# Altium schematic sheet POLLLUTAG_1.SchDoc
size 420 x 297 mm; Scale: {Масш.}; Title1str: {Наименование}; PageSetup: Record=PageOptions|CenterHorizontal=False|CenterVertical=False|PrintScale=0.67|XCorrection=0.00|YCorrection=0.00|PrintKind=1|BorderSize=5000000|LeftOffset=0|BottomOffset=0|Orientation=2|PaperLength=2970|PaperWidth=2100|Scale=100|PaperSource=7|PrintQuality=600|MediaType=1|DitherType=10|PaperKind=A4|PrintScaleMode=1; Title2str: {Наименование}; Mass: {Масса}; Letter1Column: {}; Letter2Column: {}; Letter3Column: {}; DocumentType: Панель индикации; DocumentType1str: {Документ}; DocumentType2str: {Документ}
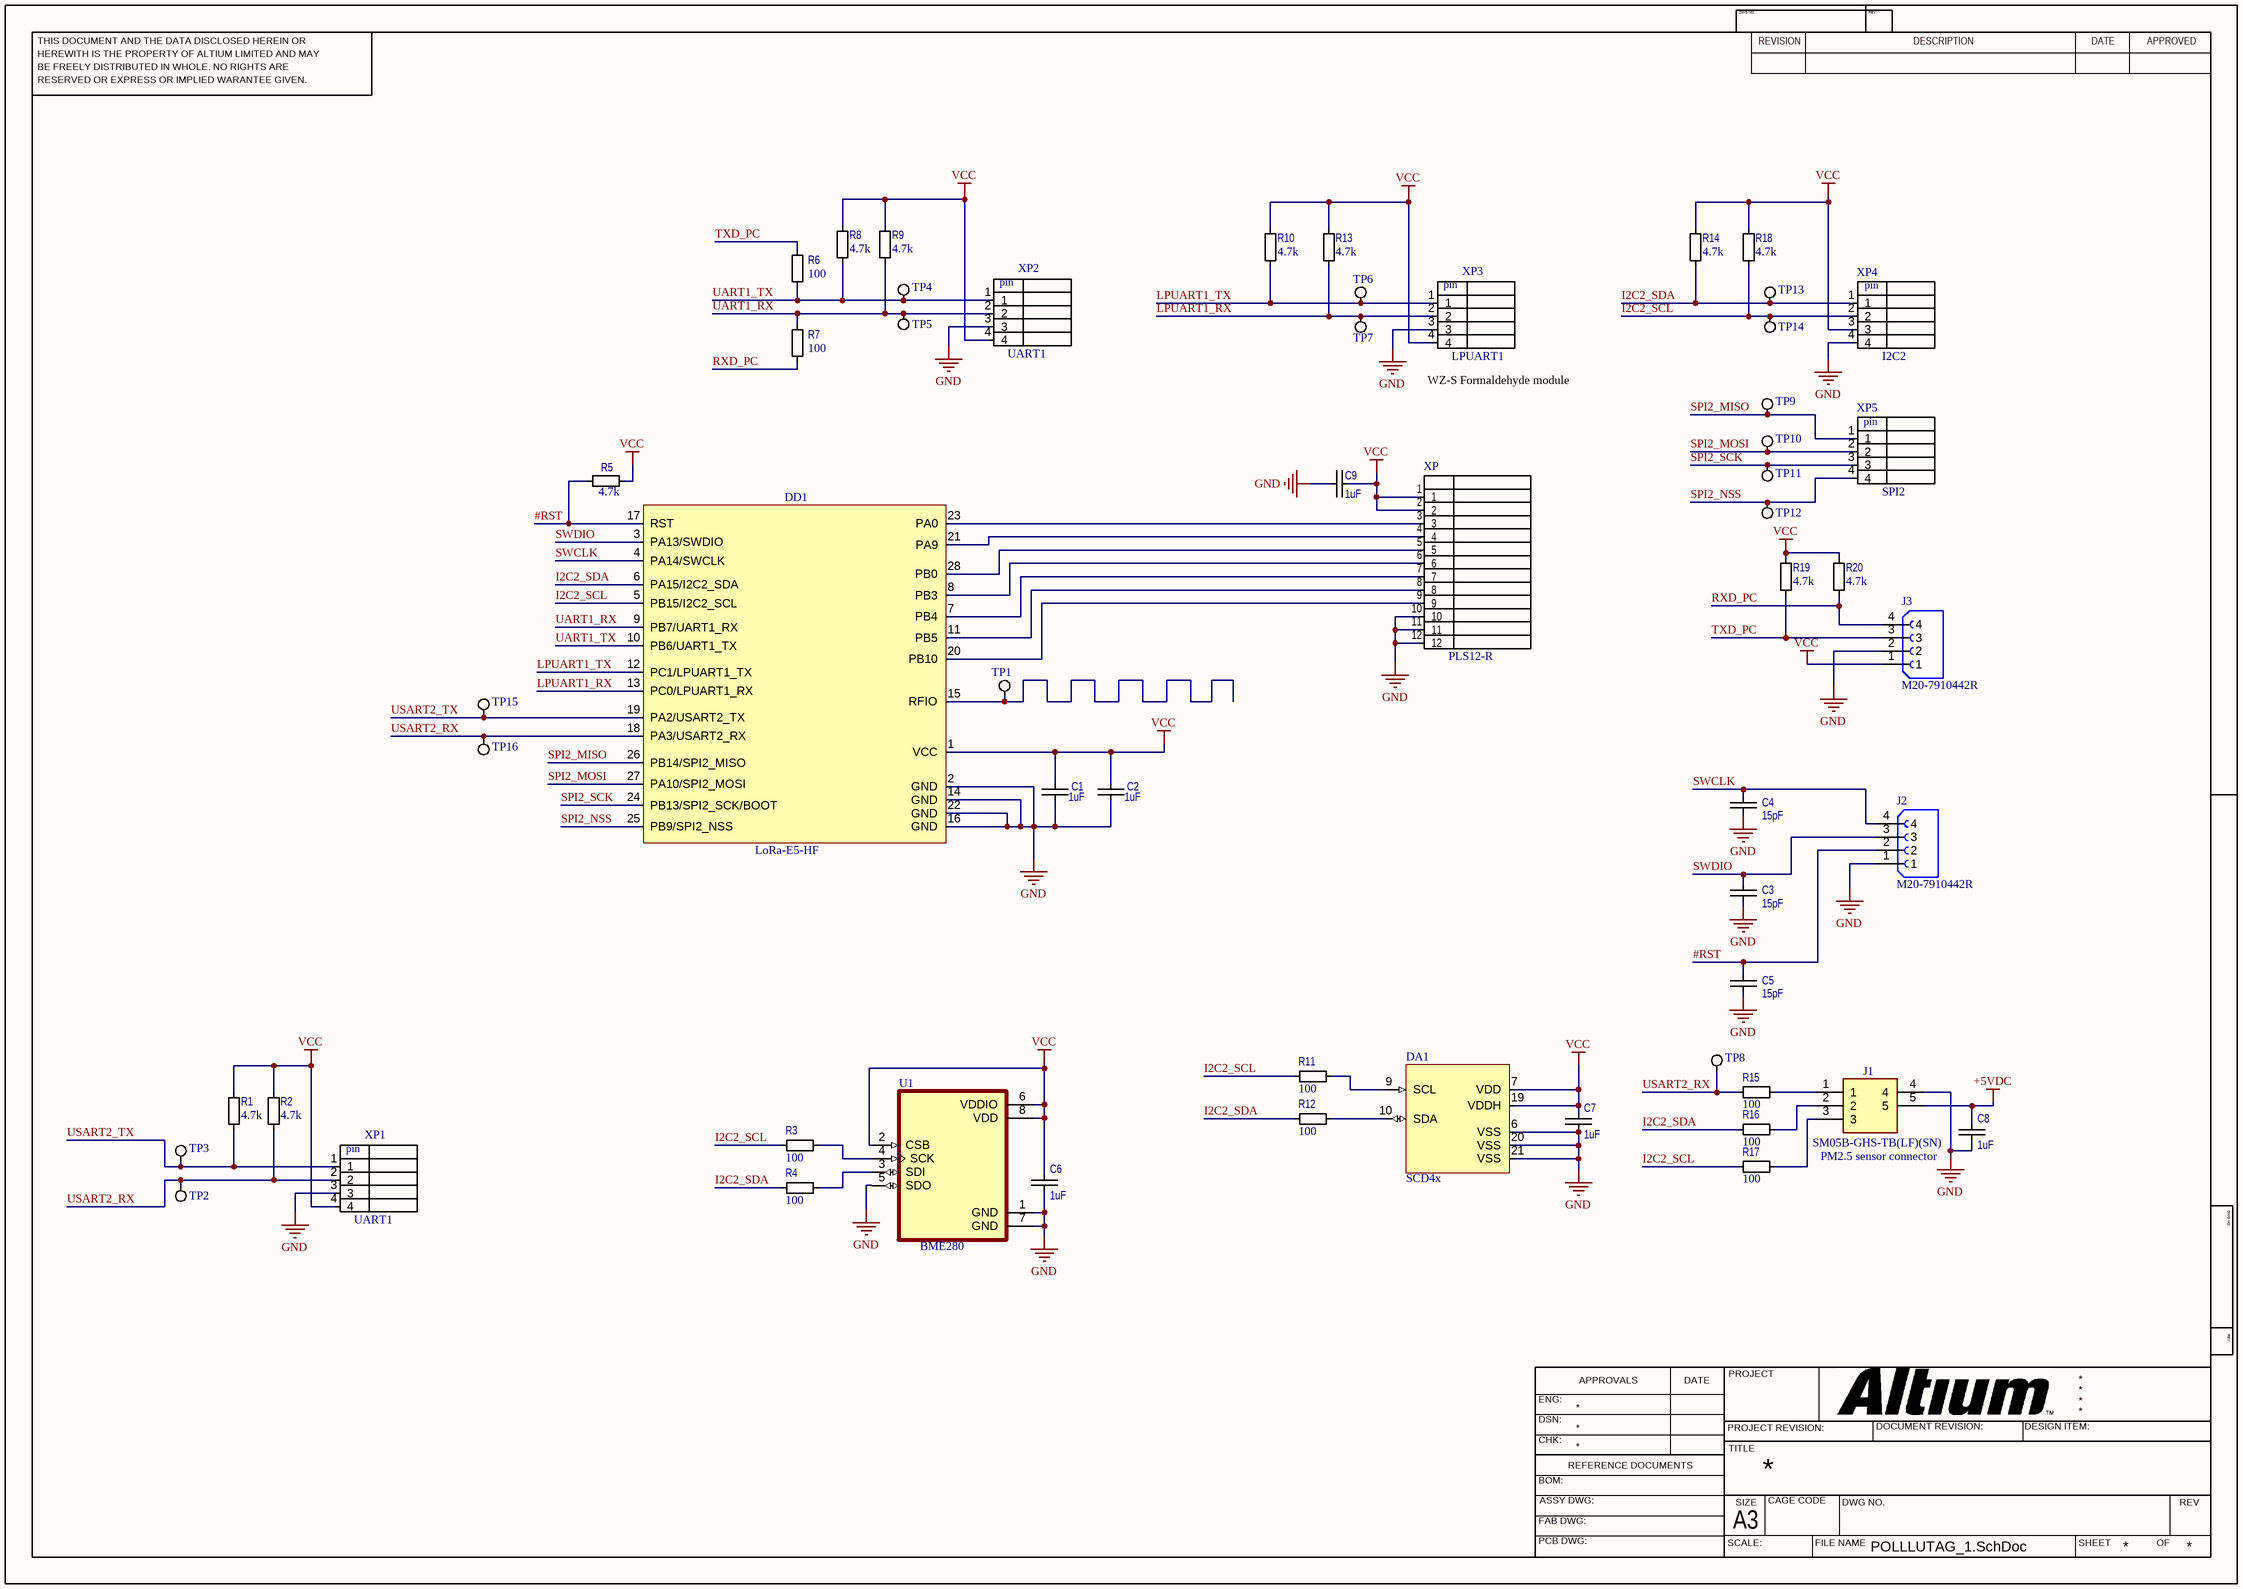
[diagram p0: POLLLUTAG_1.SchDoc]

## Parts
C1  1uF  [CAP_0603]
C2  1uF  [CAP_0603]
C3  15pF  [CAP_0603]
C4  15pF  [CAP_0603]
C5  15pF  [CAP_0603]
C6  1uF  [CAP_0603]
C7  1uF  [CAP_0603]
C8  1uF  [CAP_0603]
C9  1uF  [CAP_0603]
DA1  SCD4x  [SCD4x]
DD1  LoRa-E5-HF  [LCC28_1.25_7x7]
J1  SM05B-GHS-TB(LF)(SN)  [SM05B-GHS-TB]
J2  M20-7910442R  [M20-7910442R]
J3  M20-7910442R  [M20-7910442R]
R1  4.7k  [RES_0402]
R2  4.7k  [RES_0402]
R3  100  [RES_0402]
R4  100  [RES_0402]
R5  4.7k  [RES_0402]
R6  100  [RES_0402]
R7  100  [RES_0402]
R8  4.7k  [RES_0402]
R9  4.7k  [RES_0402]
R10  4.7k  [RES_0402]
R11  100  [RES_0402]
R12  100  [RES_0402]
R13  4.7k  [RES_0402]
R14  4.7k  [RES_0402]
R15  100  [RES_0402]
R16  100  [RES_0402]
R17  100  [RES_0402]
R18  4.7k  [RES_0402]
R19  4.7k  [RES_0402]
R20  4.7k  [RES_0402]
TP1  (no value)  [TEST POINT]
TP2  (no value)  [TEST POINT]
TP3  (no value)  [TEST POINT]
TP4  (no value)  [TEST POINT]
TP5  (no value)  [TEST POINT]
TP6  (no value)  [TEST POINT]
TP7  (no value)  [TEST POINT]
TP8  (no value)  [TEST POINT]
TP9  (no value)  [TEST POINT]
TP10  (no value)  [TEST POINT]
TP11  (no value)  [TEST POINT]
TP12  (no value)  [TEST POINT]
TP13  (no value)  [TEST POINT]
TP14  (no value)  [TEST POINT]
TP15  (no value)  [TEST POINT]
TP16  (no value)  [TEST POINT]
U1  BME280  [PSON65P250X250X100-8N - duplicate]
XP  PLS12-R  [PLS12-R]
XP1  UART1  [CONN_2.54_4]
XP2  UART1  [CONN_2.54_4]
XP3  LPUART1  [CONN_2.54_4]
XP4  I2C2  [CONN_2.54_4]
XP5  SPI2  [CONN_2.54_4]

## Nets
+5VDC: C8.2 J1.5
GND: C1.1 C2.1 C3.1 C4.1 C5.1 C6.1 C7.1 C8.1 C9.2 DA1.6(VSS) DA1.20(VSS) DA1.21(VSS) DD1.2(GND) DD1.14(GND) DD1.16(GND) DD1.22(GND) J1.4 J2.1 J3.2 U1.1(GND) U1.5(SDO) U1.7(GND) XP.10 XP.11 XP.12 XP1.3 XP2.3 XP3.3 XP4.4
VCC: C1.2 C2.2 C6.2 C7.2 C9.1 DA1.7(VDD) DA1.19(VDDH) DD1.1(VCC) J3.1 R1.1 R2.1 R5.1 R8.1 R9.1 R10.1 R13.1 R14.1 R18.1 R19.1 R20.1 U1.2(CSB) U1.6(VDDIO) U1.8(VDD) XP.1 XP.2 XP1.4 XP2.4 XP3.4 XP4.3
#RST: C5.2 DD1.17(RST) J2.2 R5.2
I2C2_SCL: DD1.5(PB15/I2C2_SCL) R3.1 R11.1 R17.1 R18.2 TP14.1 XP4.2
I2C2_SDA: DD1.6(PA15/I2C2_SDA) R4.1 R12.1 R14.2 R16.1 TP13.1 XP4.1
LPUART1_RX: DD1.13(PC0/LPUART1_RX) R13.2 TP7.1 XP3.2
LPUART1_TX: DD1.12(PC1/LPUART1_TX) R10.2 TP6.1 XP3.1
RXD_PC: J3.4 R7.2 R20.2
SPI2_MISO: DD1.26(PB14/SPI2_MISO) TP9.1 XP5.1
SPI2_MOSI: DD1.27(PA10/SPI2_MOSI) TP10.1 XP5.2
SPI2_NSS: DD1.25(PB9/SPI2_NSS) TP12.1 XP5.4
SPI2_SCK: DD1.24(PB13/SPI2_SCK/BOOT) TP11.1 XP5.3
SWCLK: C4.2 DD1.4(PA14/SWCLK) J2.4
SWDIO: C3.2 DD1.3(PA13/SWDIO) J2.3
TXD_PC: J3.3 R6.1 R19.2
UART1_RX: DD1.9(PB7/UART1_RX) R7.1 R9.2 TP5.1 XP2.2
UART1_TX: DD1.10(PB6/UART1_TX) R6.2 R8.2 TP4.1 XP2.1
USART2_RX: DD1.18(PA3/USART2_RX) R2.2 R15.1 TP2.1 TP8.1 TP16.1 XP1.2
USART2_TX: DD1.19(PA2/USART2_TX) R1.2 TP3.1 TP15.1 XP1.1
NetDA1_9: DA1.9(SCL) R11.2
NetDA1_10: DA1.10(SDA) R12.2
NetDD1_7: DD1.7(PB4) XP.7
NetDD1_8: DD1.8(PB3) XP.6
NetDD1_11: DD1.11(PB5) XP.8
NetDD1_15: DD1.15(RFIO) TP1.1
NetDD1_20: DD1.20(PB10) XP.9
NetDD1_21: DD1.21(PA9) XP.4
NetDD1_23: DD1.23(PA0) XP.3
NetDD1_28: DD1.28(PB0) XP.5
NetJ1_1: J1.1 R15.2
NetJ1_2: J1.2 R16.2
NetJ1_3: J1.3 R17.2
NetR3_2: R3.2 U1.4(SCK)
NetR4_2: R4.2 U1.3(SDI)

## Notes on the sheet
- (near XP2) pin
- (near XP3) pin
- (near XP4) pin
- (near XP3) WZ-S Formaldehyde module
- (near XP5) pin
- (near XP1) pin
- PM2.5 sensor connector
- THIS DOCUMENT AND THE DATA DISCLOSED HEREIN OR
- HEREWITH IS THE PROPERTY OF ALTIUM LIMITED AND MAY
- DWG NO:
- REVISION
- REV:
- DESCRIPTION
- DATE
- APPROVED
- BE FREELY DISTRIBUTED IN WHOLE. NO RIGHTS ARE
- RESERVED OR EXPRESS OR IMPLIED WARANTEE GIVEN.
- ENG:
- APPROVALS
- PROJECT
- DSN:
- CHK:
- REFERENCE DOCUMENTS
- PROJECT REVISION:
- TITLE
- DOCUMENT REVISION:
- DESIGN ITEM:
- BOM:
- FAB DWG:
- PCB DWG:
- ASSY DWG:
- SCALE:
- A3
- SIZE
- CAGE CODE
- FILE NAME
- DWG NO.
- SHEET
- OF
- REV

## Library data of the parts
C1 C2 C6-C9 = Cap_0603: 0603 1 uF 25 V ±10% Tolerance X7R Surface Mount; Manufacturer: AVX; Part Number: 0603YC105KAT2A; Replacement: GRM188R71E105KA12D; PackageReference: 0603; Value: 1uF; Distributor: http://www.rospek.ru; Price: 3.00
C3-C5 = Cap_0603: Multilayer Ceramic Capacitors MLCC - SMD/SMT 50 V 15 pF C0G 0603 5%; Manufacturer: YAGEO; Part Number: CC0603JRNPO9BN150; PackageReference: 0603; Value: 15pF; Distributor: mouser.com; Price: 0.2
DA1 = SCD4x: Air Quality Sensors Sensirion photoacoustic CO2 sensor; Part Number: SCD41-D-R2; Manufacturer: Sensirion
DD1 = LoRa-E5 Seeed: LoRa Wireless Module - Powered by STM32WE; Manufacturer: SEEED STUDIO; Part Number: LoRa-E5-HF
J1 = SM05B-GHS-TB_LF__SN_: JST GH Series, 1.25mm Pitch 5 Way Right Angle PCB Header, Solder Termination, 1A; Manufacturer: JST; Part Number: SM05B-GHS-TB(LF)(SN); Mouser Part Number: *; Mouser Price/Stock: *; Arrow Part Number: SM05B-GHS-TB(LF)(SN); Arrow Price/Stock: https://www.arrow.com/en/products/sm05b-ghs-tb-lf-sn/jst-manufacturing; Datasheet Link: https://datasheet.datasheetarchive.com/originals/distributors/Datasheets_SAMA/e4ef010dc292ea31091454f6c0afb63a.pdf
J2 = M20-7910442R: 4 Position Receptacle Connector 0.100 (2.54mm) Surface Mount, Right Angle Gold; Manufacturer: Harwin Inc.; Part  Number: M20-7910442R; Check_prices: https://www.snapeda.com/parts/M20-7910442R/Harwin+Inc./view-part/?ref=eda; Purchase-URL: https://pricing.snapeda.com/search/part/M20-7910442R/?ref=eda; Digi-Key_Part_Number: 952-3197-2-ND
J3 = M20-7910442R: 4 Position Receptacle Connector 0.100 (2.54mm) Surface Mount, Right Angle Gold; Part Number: 'M20-7910442R'; Manufacturer: Harwin Inc.; SnapEDA_Link: https://www.snapeda.com/parts/M20-7910442R/Harwin+Inc./view-part/?ref=snap; Check_prices: https://www.snapeda.com/parts/M20-7910442R/Harwin+Inc./view-part/?ref=eda; Purchase-URL: https://pricing.snapeda.com/search/part/M20-7910442R/?ref=eda; Digi-Key_Part_Number: 952-3197-2-ND; Value: *
R1 R2 R5 R8-R10 R13 R14 R18-R20 = Res_0402: 0402RES, 4.7K, 0.0625W, 1%, THICK FILM, 0402; Manufacturer: BOURNS; Part Number: CR0402-FX-4701GLF; Replacement: 0402 4.7kOhm 5%; PackageReference: 0402; Value: 4.7k; Distributor: http://www.kontest.ru; Price: 0.01$
R3 R4 R6 R7 R11 R12 R15-R17 = Res_0402: Thick Film Resistors - SMD 100 OHM 1%; Manufacturer: BOURNS; Part Number: CR0402-FX-1000GLF; Replacement: 0402 100 Ohm 5%; PackageReference: 0402; Value: 100; Distributor: http://www.kontest.ru; Price: 0.01$
TP1-TP16 = TEST_POINT_SMALL: test point pad; Value: JMP; Price: 0.05$
U1 = BME280: DIGITAL HUMIDITY, PRESSURE AND TEMPERATURE SENSOR<br>* Digital interface IÂ²C (up to 3.4 MHz) and SPI (3 and 4 wire, up to 10 MHz)* Supply voltage VDD main supply voltage range: 1.71 V to 3.6 V*VDDIO interface voltage range: 1.2 V to 3.6 V<br> Operating range -40â€¦+85 Â°C, 0â€¦100 % rel. humidity, 300â€¦1100 hPa <br><br>  The library has been designed by<a href="https://www.facebook.com/groups/eaglecadsoftUK"> Richard Magdycz</a>; Manufacturer: BOSCH; Package: None; Availability: Unavailable; Part Number: BME280; Value: *; Price: None
XP = PLS12-R: Manufacturer: TE; Price: 0.03$; Part Number: PLS12-R; PackageReference: SIP 2,54
XP1-XP5 = CONNECT_SWD